# Altium schematic sheet SFP.SchDoc
size 420 x 297 mm; SheetNumber: 3; SheetTotal: 7
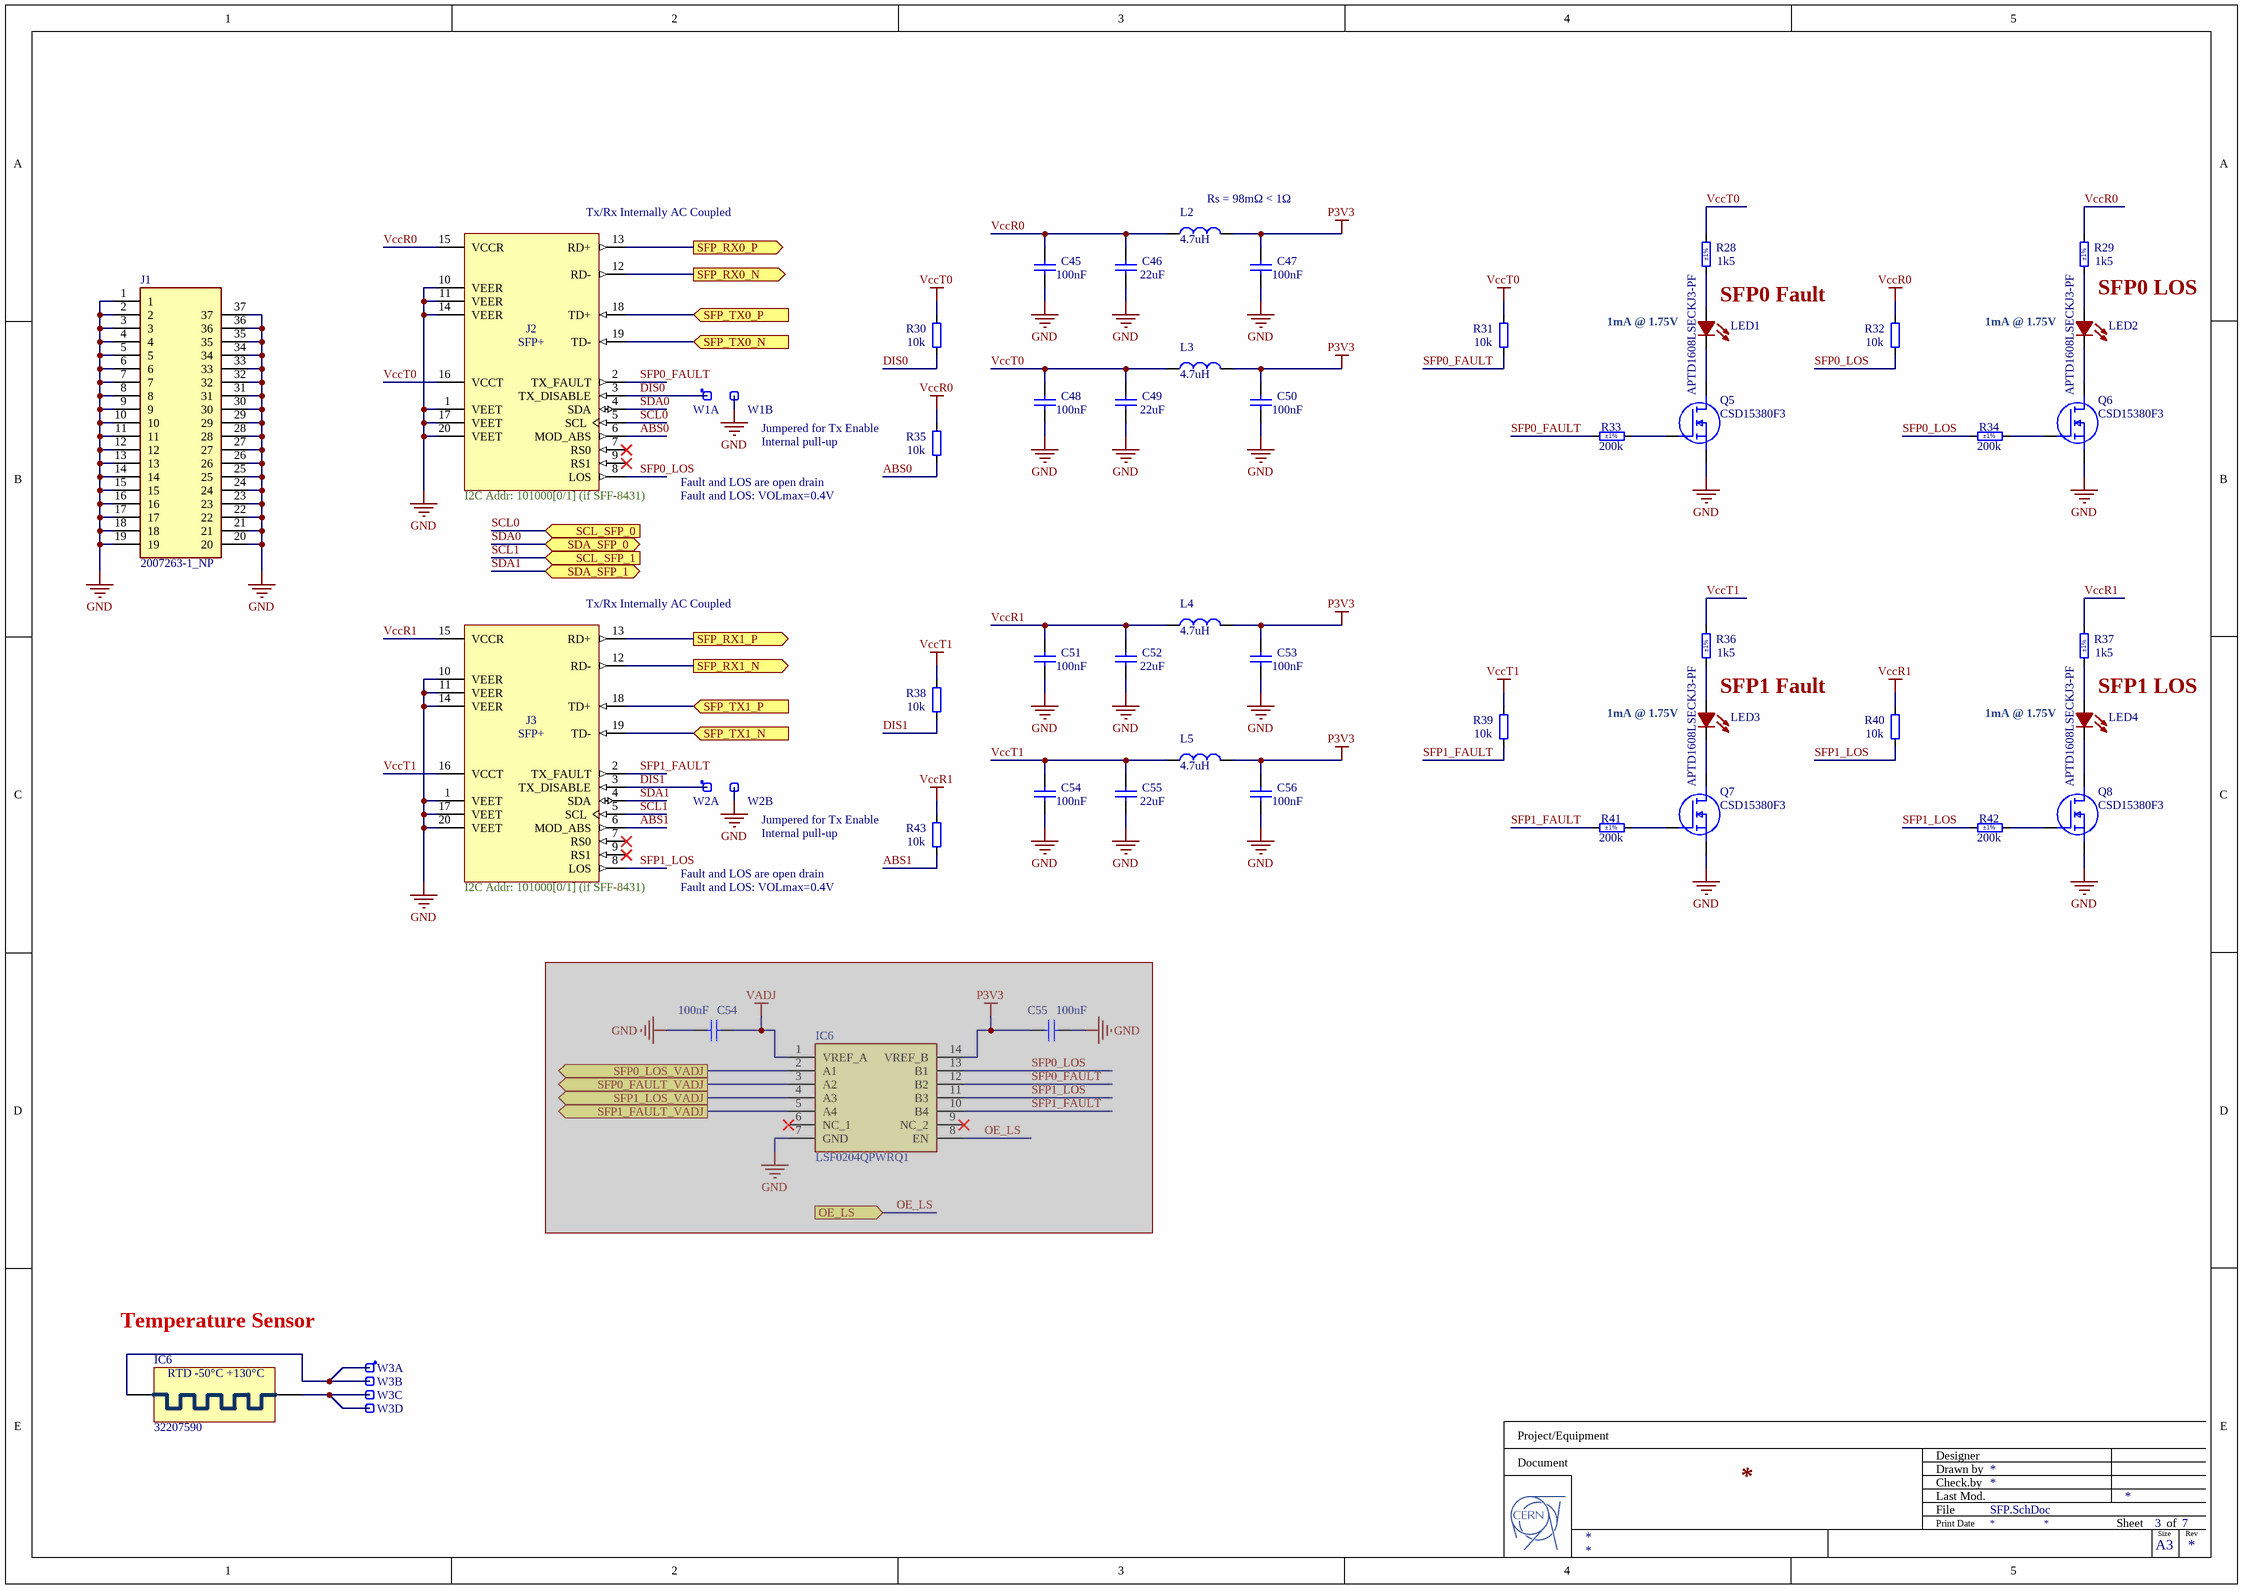
[diagram p0: SFP.SchDoc]

## Parts
(Parts that share a designator on the sheet are numbered #1, #2 ... from top to bottom, then left to right.)
C45  100nF  [MURATA_HI_DENSITY_0201]
C46  22uF  [MURATA_HI_DENSITY_0402_CAP]
C47  100nF  [MURATA_HI_DENSITY_0201]
C48  100nF  [MURATA_HI_DENSITY_0201]
C49  22uF  [MURATA_HI_DENSITY_0402_CAP]
C50  100nF  [MURATA_HI_DENSITY_0201]
C51  100nF  [MURATA_HI_DENSITY_0201]
C52  22uF  [MURATA_HI_DENSITY_0402_CAP]
C53  100nF  [MURATA_HI_DENSITY_0201]
C54#1  100nF  [MURATA_HI_DENSITY_0201]
C54#2  100nF  [MURATA_HI_DENSITY_0201]  (masked out: inside a compile mask, not in the netlist)
C55#1  22uF  [MURATA_HI_DENSITY_0402_CAP]
C55#2  100nF  [MURATA_HI_DENSITY_0201]  (masked out: inside a compile mask, not in the netlist)
C56  100nF  [MURATA_HI_DENSITY_0201]
IC6#1  LSF0204QPWRQ1  [SOP65P640X120-14N]  (masked out: inside a compile mask, not in the netlist)
IC6#2  32207590  [PT100]
J1  2007263-1_NP  [20072631_NP]
J2  SFP+  [TYCO_1888247-1]
J3  SFP+  [TYCO_1888247-1]
L2  4.7uH  [DFE322520FD1R0MP2]
L3  4.7uH  [DFE322520FD1R0MP2]
L4  4.7uH  [DFE322520FD1R0MP2]
L5  4.7uH  [DFE322520FD1R0MP2]
LED1  APTD1608LSECKJ3-PF  [LED_APTD1608LSECKJ3-PF_KNB]
LED2  APTD1608LSECKJ3-PF  [LED_APTD1608LSECKJ3-PF_KNB]
LED3  APTD1608LSECKJ3-PF  [LED_APTD1608LSECKJ3-PF_KNB]
LED4  APTD1608LSECKJ3-PF  [LED_APTD1608LSECKJ3-PF_KNB]
Q5  CSD15380F3  [CSD15380F3]
Q6  CSD15380F3  [CSD15380F3]
Q7  CSD15380F3  [CSD15380F3]
Q8  CSD15380F3  [CSD15380F3]
R28  1k5  Tolerance: ±1%  [RESC1005X40N]
R29  1k5  Tolerance: ±1%  [RESC1005X40N]
R30  10k  [MURATA_HI_DENSITY_0201]
R31  10k  [MURATA_HI_DENSITY_0201]
R32  10k  [MURATA_HI_DENSITY_0201]
R33  200k  Tolerance: ±1%  [RESC1005X40N]
R34  200k  Tolerance: ±1%  [RESC1005X40N]
R35  10k  [MURATA_HI_DENSITY_0201]
R36  1k5  Tolerance: ±1%  [RESC1005X40N]
R37  1k5  Tolerance: ±1%  [RESC1005X40N]
R38  10k  [MURATA_HI_DENSITY_0201]
R39  10k  [MURATA_HI_DENSITY_0201]
R40  10k  [MURATA_HI_DENSITY_0201]
R41  200k  Tolerance: ±1%  [RESC1005X40N]
R42  200k  Tolerance: ±1%  [RESC1005X40N]
R43  10k  [MURATA_HI_DENSITY_0201]
W1  Header 2  [SAMTEC_HTSW-102-23-L-S]  (value not drawn)  (parts A,B of 2)
W2  Header 2  [SAMTEC_HTSW-102-23-L-S]  (value not drawn)  (parts A,B of 2)
W3  Header 4  [SAMTEC_HTSW-104-23-L-S]  (value not drawn)  (parts A,B,C,D of 4)

## Ports
OE_LS (in), SCL_SFP_0 (in), SCL_SFP_1 (in), SDA_SFP_0 (bidir), SDA_SFP_1 (bidir), SFP0_FAULT_VADJ (out), SFP0_LOS_VADJ (out), SFP1_FAULT_VADJ (out), SFP1_LOS_VADJ (out), SFP_RX0_N (out), SFP_RX0_P (out), SFP_RX1_N (out), SFP_RX1_P (out), SFP_TX0_N (in), SFP_TX0_P (in), SFP_TX1_N (in), SFP_TX1_P (in)

## Nets
GND: C45.1 C46.1 C47.1 C48.1 C49.1 C50.1 C51.1 C52.1 C53.1 C54#1.1 C55#1.1 C56.1 J1.1 J1.2 J1.3 J1.4 J1.5 J1.6 J1.7 J1.8 J1.9 J1.10 J1.11 J1.12 J1.13 J1.14 J1.15 J1.16 J1.17 J1.18 J1.19 J1.20 J1.21 J1.22 J1.23 J1.24 J1.25 J1.26 J1.27 J1.28 J1.29 J1.30 J1.31 J1.32 J1.33 J1.34 J1.35 J1.36 J1.37 J2.1(VEET) J2.10(VEER) J2.11(VEER) J2.14(VEER) J2.17(VEET) J2.20(VEET) J3.1(VEET) J3.10(VEER) J3.11(VEER) J3.14(VEER) J3.17(VEET) J3.20(VEET) Q5.2(S) Q6.2(S) Q7.2(S) Q8.2(S) W1.2 W2.2
P3V3: C47.2 C50.2 C53.2 C56.2 L2.2 L3.2 L4.2 L5.2
VccR0: C45.2 C46.2 J2.15(VCCR) L2.1 R29.2 R32.2 R35.2
VccR1: C51.2 C52.2 J3.15(VCCR) L4.1 R37.2 R40.2 R43.2
VccT0: C48.2 C49.2 J2.16(VCCT) L3.1 R28.2 R30.2 R31.2
VccT1: C54#1.2 C55#1.2 J3.16(VCCT) L5.1 R36.2 R38.2 R39.2
ABS0: J2.6(MOD_ABS) R35.1
ABS1: J3.6(MOD_ABS) R43.1
DIS0: J2.3(TX_DISABLE) R30.1 W1.1
DIS1: J3.3(TX_DISABLE) R38.1 W2.1
SCL0: J2.5(SCL) ; port SCL_SFP_0
SCL1: J3.5(SCL) ; port SCL_SFP_1
SDA0: J2.4(SDA) ; port SDA_SFP_0
SDA1: J3.4(SDA) ; port SDA_SFP_1
SFP0_FAULT: J2.2(TX_FAULT) R31.1 R33.1
SFP0_LOS: J2.8(LOS) R32.1 R34.1
SFP1_FAULT: J3.2(TX_FAULT) R39.1 R41.1
SFP1_LOS: J3.8(LOS) R40.1 R42.1
SFP_RX0_N: J2.12(RD-) ; port SFP_RX0_N
SFP_RX0_P: J2.13(RD+) ; port SFP_RX0_P
SFP_RX1_N: J3.12(RD-) ; port SFP_RX1_N
SFP_RX1_P: J3.13(RD+) ; port SFP_RX1_P
SFP_TX0_N: J2.19(TD-) ; port SFP_TX0_N
SFP_TX0_P: J2.18(TD+) ; port SFP_TX0_P
SFP_TX1_N: J3.19(TD-) ; port SFP_TX1_N
SFP_TX1_P: J3.18(TD+) ; port SFP_TX1_P
NetIC6#2_1: IC6#2.1 W3.1 W3.2
NetIC6#2_2: IC6#2.2 W3.3 W3.4
NetLED1_1: LED1.1(C) Q5.3(D)
NetLED1_2: LED1.2(A) R28.1
NetLED2_1: LED2.1(C) Q6.3(D)
NetLED2_2: LED2.2(A) R29.1
NetLED3_1: LED3.1(C) Q7.3(D)
NetLED3_2: LED3.2(A) R36.1
NetLED4_1: LED4.1(C) Q8.3(D)
NetLED4_2: LED4.2(A) R37.1
NetQ5_1: Q5.1(G) R33.2
NetQ6_1: Q6.1(G) R34.2
NetQ7_1: Q7.1(G) R41.2
NetQ8_1: Q8.1(G) R42.2

Not connected (* = marked no-connect by the designer): J2 7(RS0)* 9(RS1)*; J3 7(RS0)* 9(RS1)*

## Notes on the sheet
- (near J2) Tx/Rx Internally AC Coupled
- (near L2) Rs = 98mΩ < 1Ω
- (near LED1) 1mA @ 1.75V
- SFP0 Fault
- (near LED2) 1mA @ 1.75V
- SFP0 LOS
- Jumpered for Tx Enable
- (near W1) Internal pull-up
- (near J2) I2C Addr: 101000[0/1] (if SFF-8431)
- Fault and LOS are open drain
- Fault and LOS: VOLmax=0.4V
- (near J3) Tx/Rx Internally AC Coupled
- (near LED3) 1mA @ 1.75V
- SFP1 Fault
- (near LED4) 1mA @ 1.75V
- SFP1 LOS
- (near W2) Internal pull-up
- (near J3) I2C Addr: 101000[0/1] (if SFF-8431)
- Temperature Sensor
- Project/Equipment
- Document
- Designer
- Drawn by
- Check.by
- File
- Last Mod.
- Print Date
- Sheet
- Size
- A3
- of
- Rev
- (in symbol PT100) RTD; -50°C +130°C

## Library data of the parts
C45 C47 C48 C50 C51 C53 C54#1 C54#2 C55#2 C56 = C0201-100nF-high-density: GRM033R61C104KE14; Vmax: 16V; Value: 100nF
C46 C49 C52 C55#1 = C0402-22uF-high-density: GRM155R60J226ME11; Vmax: 6.3V; Value: 22uF
IC6#1 = LSF0204QPWRQ1: Integrated Circuit; Manufacturer_Name: Texas Instruments; Datasheet Link: http://www.ti.com/lit/gpn/lsf0204-q1; Height: 1.2mm; Manufacturer_Part_Number: LSF0204QPWRQ1; Mouser Part Number: 595-LSF0204QPWRQ1; Mouser Price/Stock: https://www.mouser.co.uk/ProductDetail/Texas-Instruments/LSF0204QPWRQ1?qs=w%2Fv1CP2dgqqt88p%2F1xId1A%3D%3D; Arrow Part Number: LSF0204QPWRQ1; Arrow Price/Stock: https://www.arrow.com/en/products/lsf0204qpwrq1/texas-instruments?region=nac
IC6#2 = PT100: 32207590 - PT100 - 1206 - 0.3degC - -50/130
J1 = 2007263-1_NP: Connector; Manufacturer_Name: TE Connectivity; Datasheet Link: https://www.te.com/commerce/DocumentDelivery/DDEController?Action=srchrtrv&DocNm=4-1773455-3_Quick_Ref_Guide_SFP%2B_Sol&DocType=Data%20Sheet&DocLang=English&PartCntxt=2007263-1&DocFormat=pdf; Height: 9.8mm; Manufacturer_Part_Number: 2007263-1; Mouser Part Number: 571-2007263-1; Mouser Price/Stock: https://www.mouser.co.uk/ProductDetail/TE-Connectivity/2007263-1?qs=4zF2lffhceF8GItBX4M8mw%3D%3D; Arrow Part Number: 2007263-1; Arrow Price/Stock: https://www.arrow.com/en/products/2007263-1/te-connectivity?region=europe
J2 J3 = TYCO_1888247-1: 20 Position SFP+ Connector (Small Form-factor Pluggable); Part Description: 20 Position, Pitch 0.8mm SFP+ Receptacle (Small Form-factor Pluggable); Manufacturer: TYCO ELECTRONICS; PressFit: No; Part Number: TYCO_1888247-1; Component Kind: Standard; Component Type: Standard; Pin Count: 20; Family: SFP+; Mounted: Yes; Socket: No; SMD: Yes; Sense: No; Status: None; Manufacturer Part Number: 1888247-1; ComponentHeight: 5.4mm; HelpURL: \\cern.ch\dfs\Applications\Altium\Datasheets\TYCO_1888247-1.pdf; Author: CERN DEM JLC; CreateDate: 2/27/2012; LatestRevisionDate: 2/27/2012
L2-L5 = DFE322520FD-4R7M=P2: Inductor; Manufacturer_Name: Murata Electronics; Datasheet Link: https://search.murata.co.jp/Ceramy/image/img/P02/J(E)TE243A-9104.pdf; Height: 2mm; Manufacturer_Part_Number: DFE322520FD-4R7M=P2; Mouser Part Number: 81-DFE322520FD4R7MP2; Mouser Price/Stock: https://www.mouser.co.uk/ProductDetail/Murata-Electronics/DFE322520FD-4R7M%3dP2?qs=17u8i%2FzlE8%252BgAY54mivQ1g%3D%3D; Arrow Part Number: DFE322520FD-4R7M=P2; Arrow Price/Stock: https://www.arrow.com/en/products/dfe322520fd-4r7mp2/murata-manufacturing?region=nac
LED1-LED4 = APTD1608LSECKJ3-PF: Led Red 0603 2mA 1.8V 50mcd 84mW; Mfr_Name: Kingbright
Q5-Q8 = CSD15380F3: MOSFET (N-Channel); Manufacturer_Name: Texas Instruments; Datasheet Link: https://www.ti.com/lit/ds/symlink/csd15380f3.pdf?ts=1641221366106&ref_url=https%253A%252F%252Fwww.google.com%252F; Height: 0.35mm; Manufacturer_Part_Number: CSD15380F3; Mouser Part Number: 595-CSD15380F3; Mouser Price/Stock: https://www.mouser.co.uk/ProductDetail/Texas-Instruments/CSD15380F3?qs=zEmsApcVOkXP46xhm0edmA%3D%3D; Arrow Part Number: CSD15380F3; Arrow Price/Stock: https://www.arrow.com/en/products/csd15380f3/texas-instruments?region=nac
R28 R29 R36 R37 = R0402_1K5_1%_0.0625W_100PPM: Resistor - 1%; Part Description: General Purpose Thick Film Chip Resistor; Manufacturer: GENERIC; Manufacturer1 Part Number: 232270671502L; TC: ±100ppm/°C; PressFit: No; Part Number: R0402_1K5_1%_0.0625W_100PPM; Component Kind: Standard; Component Type: Standard; Pin Count: 2; Value: 1k5; Status: Not Recommended; Power: 0.0625W; Manufacturer Part Number: R0402_1K5_1%_0.0625W_100PPM; Case: 0402; Mounted: Yes; Sense: No; Socket: No; SMD: Yes; Manufacturer1 Example: YAGEO PHYCOMP; Manufacturer1 ComponentHeight: 0.4mm; HelpURL: \\cern.ch\dfs\Applications\Altium\Datasheets\R0402_Phycomp_RC0402.pdf; Author: CERN DEM JLC; CreateDate: 12/3/2007; LatestRevisionDate: 10/17/2012
R30-R32 R35 R38-R40 R43 = R0201-100ohm-high-density: Resistor 10k; Value: 100Ω
R33 R34 R41 R42 = R0402_200K_1%_0.0625W_100PPM: Resistor - 1%; Part Description: General Purpose Thick Film Chip Resistor; Manufacturer: GENERIC; Manufacturer1 Part Number: 232270672004L; TC: ±100ppm/°C; PressFit: No; Part Number: R0402_200K_1%_0.0625W_100PPM; Component Kind: Standard; Component Type: Standard; Pin Count: 2; Value: 200k; Status: Not Recommended; Power: 0.0625W; Manufacturer Part Number: R0402_200K_1%_0.0625W_100PPM; Case: 0402; Mounted: Yes; Sense: No; Socket: No; SMD: Yes; Manufacturer1 Example: YAGEO PHYCOMP; Manufacturer1 ComponentHeight: 0.4mm; HelpURL: \\cern.ch\dfs\Applications\Altium\Datasheets\R0402_Phycomp_RC0402.pdf; Author: CERN DEM JLC; CreateDate: 12/3/2007; LatestRevisionDate: 10/17/2012
W1 W2 = SAMTEC_HTSW-102-23-L-S: 2 Mini Wire-Wrap Contact Strip Header; Part Description: 2 Contacts, Pitch 2.54mm, Single Row  Through Mount Straight Header (Post Lead 5.84mm, Tail Lead 2.92mm, Insulator 2.54mm); Manufacturer: SAMTEC; PressFit: No; Status Comment: High Temperature; Part Number: SAMTEC_HTSW-102-23-L-S; Component Kind: Standard; Component Type: Standard; Pin Count: 2; Family: Header 2; Mounted: Yes; Socket: No; SMD: No; Sense: No; Status: Preferred; Manufacturer Part Number: HTSW-102-23-L-S; ComponentHeight: 8.38mm; HelpURL: \\cern.ch\dfs\Applications\Altium\Datasheets\SAMTEC_HTSW-102-23-L-S.pdf; Author: CERN DEM JLC; CreateDate: 2/22/2018; LatestRevisionDate: 2/22/2018
W3 = SAMTEC_HTSW-104-23-L-S: 4 Mini Wire-Wrap Contact Strip Header; Part Description: 4 Contacts, Pitch 2.54mm, Single Row  Through Mount Straight Header (Post Lead 5.84mm, Tail Lead 2.92mm, Insulator 2.54mm); Manufacturer: SAMTEC; PressFit: No; Status Comment: High Temperature; Part Number: SAMTEC_HTSW-104-23-L-S; Component Kind: Standard; Component Type: Standard; Pin Count: 4; Family: Header 4; Mounted: Yes; Socket: No; SMD: No; Sense: No; Status: Preferred; Manufacturer Part Number: HTSW-104-23-L-S; ComponentHeight: 8.38mm; HelpURL: \\cern.ch\dfs\Applications\Altium\Datasheets\SAMTEC_HTSW-104-23-L-S.pdf; Author: CERN DEM JLC; CreateDate: 2/22/2018; LatestRevisionDate: 2/22/2018